# Altium schematic sheet POWER.SchDoc
size 386 x 304 mm
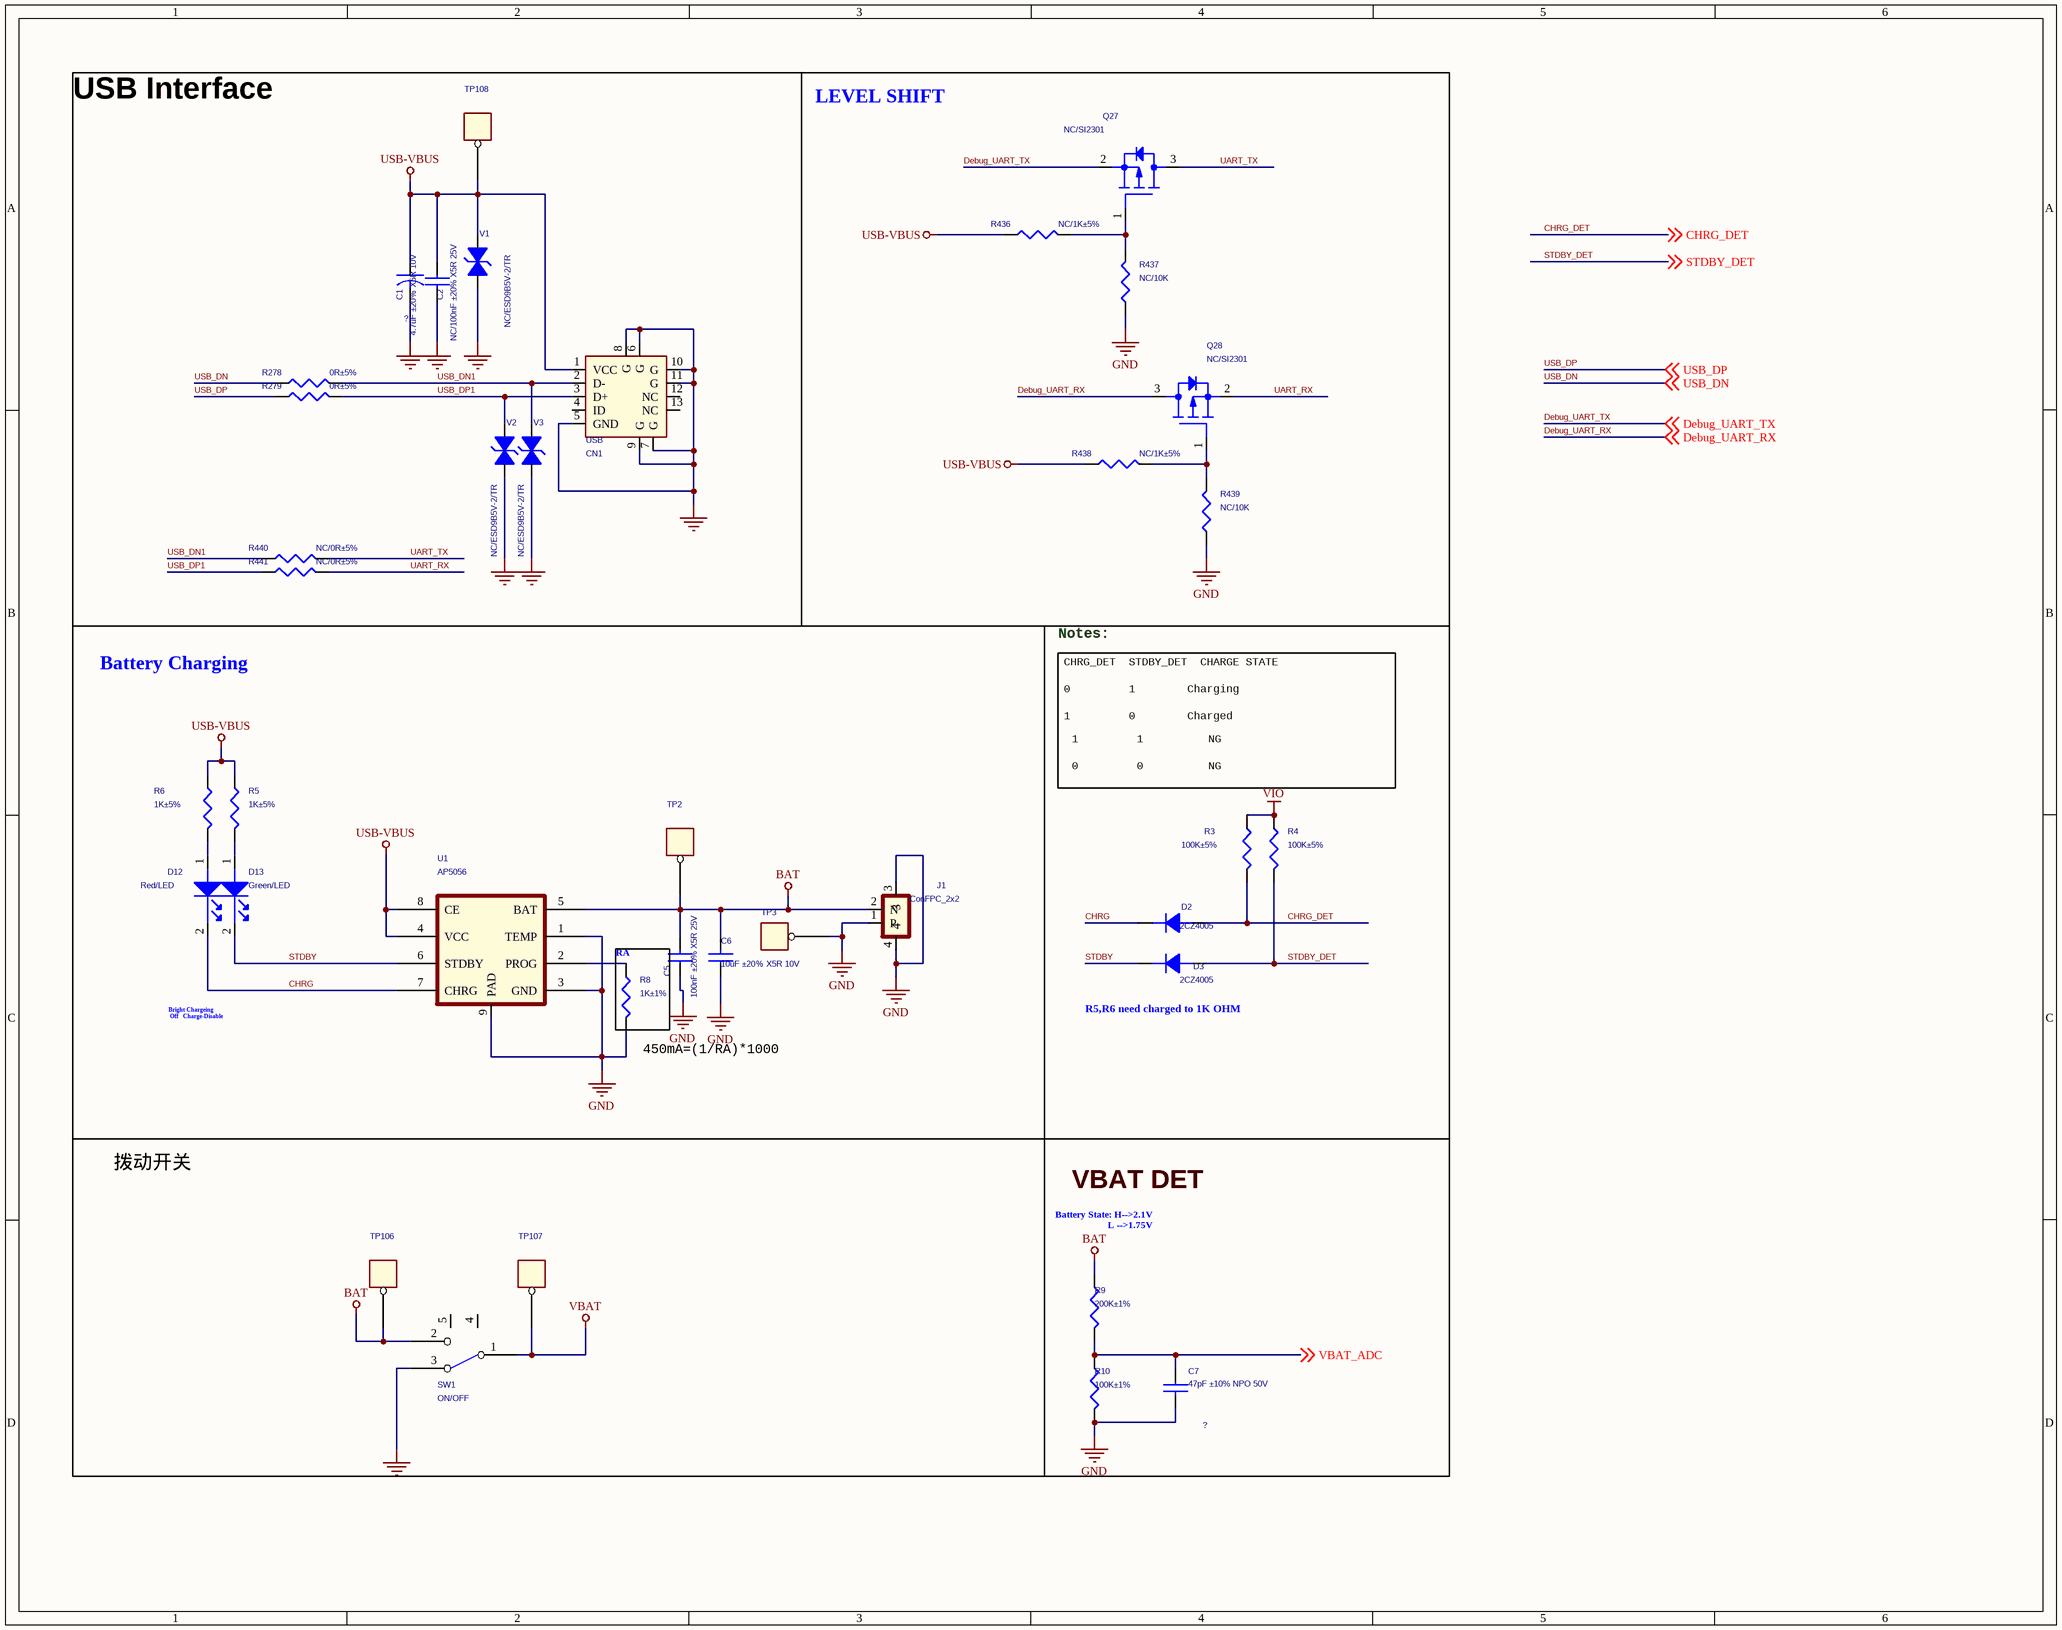
[diagram p0: POWER.SchDoc]

## Parts
C1  4.7uF ±20％ X5R 10V  [C0402]
C2  NC/100nF ±20% X5R 25V  [C0402]
C5  100nF ±20% X5R 25V  [C0402]
C6  10uF ±20％ X5R 10V  [C0603]
C7  47pF ±10% NPO 50V  [C0402]
CN1  USB  [USB_DIP5PA-GKFD]
D2  2CZ4005  [SOD-123]
D3  2CZ4005  [SOD-123]
D12  Red/LED  [LED0603]
D13  Green/LED  [LED0603]
J1  ConFPC_2x2  [PL2.0-2P-SMT]
Q27  NC/SI2301  [SOT-23]
Q28  NC/SI2301  [SOT-23]
R3  100K±5%  [R0402]
R4  100K±5%  [R0402]
R5  1K±5%  [R0402]
R6  1K±5%  [R0402]
R8  1K±1%  [R0402]
R9  200K±1%  [R0402]
R10  100K±1%  [R0402]
R278  0R±5%  [R0402]
R279  0R±5%  [R0402]
R436  NC/1K±5%  [R0402]
R437  NC/10K  [R0402]
R438  NC/1K±5%  [R0402]
R439  NC/10K  [R0402]
R440  NC/0R±5%  [R0402]
R441  NC/0R±5%  [R0402]
SW1  ON/OFF  [SW_1P2D-SK12D07VG3]
TP2  TP25RD  [TPC]  (value not drawn)
TP3  TP25RD  [TPC]  (value not drawn)
TP106  TP25RD  [TPC]  (value not drawn)
TP107  TP25RD  [TPC]  (value not drawn)
TP108  TP25RD  [TPC]  (value not drawn)
U1  AP5056  [SOP8_PAD]
V1  NC/ESD9B5V-2/TR  [ESD0402]
V2  NC/ESD9B5V-2/TR  [ESD0402]
V3  NC/ESD9B5V-2/TR  [ESD0402]

## Blocks framed on the sheet
USB Interface: C1 C2 CN1 R278 R279 R440 R441 TP108 V1-V3
LEVEL SHIFT: Q27 Q28 R436-R439
Battery Charging: C5 C6 D12 D13 J1 R5 R6 TP2 TP3 U1
Notes:: D2 D3 R3 R4
RA: R8
拨动开关: SW1 TP106 TP107
VBAT DET: C7 R9 R10

## Nets
BAT: C5.2 C6.2 J1.2(N) R9.1 SW1.2(NO) TP2.1(TP1) TP106.1(TP1) U1.5(BAT)
GND: C1.2 C2.2(Pin2) C5.1 C6.1 C7.2(Pin2) CN1.5(GND) CN1.6(G) CN1.7(G) CN1.8(G) CN1.9(G) CN1.10(G) CN1.11(G) J1.1(P) J1.3 J1.4 R8.1 R10.2 R437.1 R439.1 SW1.3(NC) TP3.1(TP1) U1.1(TEMP) U1.3(GND) U1.9(PAD) V1.2(I/O2) V2.2(I/O2) V3.2(I/O2)
USB-VBUS: C1.1 C2.1(Pin1) CN1.1(VCC) R5.2 R6.2 R436.1 R438.1 TP108.1(TP1) U1.4(VCC) U1.8(CE) V1.1(I/O1)
VBAT: SW1.1(COMMON) TP107.1(TP1)
VIO: R3.1 R4.1
CHRG: D2.2 D12.2(CATHODE) U1.7(CHRG)
CHRG_DET: D2.1 R3.2 ; off-sheet CHRG_DET
Debug_UART_RX: Q28.3(DRAIN) ; off-sheet Debug_UART_RX
Debug_UART_TX: Q27.2(SOURCE) ; off-sheet Debug_UART_TX
STDBY: D3.2 D13.2(CATHODE) U1.6(STDBY)
STDBY_DET: D3.1 R4.2 ; off-sheet STDBY_DET
UART_RX: Q28.2(SOURCE) R441.2
UART_TX: Q27.3(DRAIN) R440.2
USB_DN: R278.1 ; off-sheet USB_DN
USB_DN1: CN1.2(D-) R278.2 R440.1 V3.1(I/O1)
USB_DP: R279.1 ; off-sheet USB_DP
USB_DP1: CN1.3(D+) R279.2 R441.1 V2.1(I/O1)
VBAT_ADC: C7.1(Pin1) R9.2 R10.1 ; off-sheet VBAT_ADC
NetD12_1: D12.1(ANODE) R6.1
NetD13_1: D13.1(ANODE) R5.1
NetQ27_1: Q27.1(GATE) R436.2 R437.2
NetQ28_1: Q28.1(GATE) R438.2 R439.2
NetR8_2: R8.2 U1.2(PROG)

Not connected (* = marked no-connect by the designer): CN1 4(ID) 12(NC) 13(NC); SW1 4(NC) 5(NC)

## Notes on the sheet
- CHRG_DET  STDBY_DET  CHARGE STATE
- 0         1        Charging
- 1         0        Charged
- 1         1          NG
- 0         0          NG
- Bright Chargeing
  Off   Charge-Disable
- (near D3) R5,R6 need charged to 1K OHM
- (near R8) 450mA=(1/RA)*1000
- Battery State: H-->2.1V
  L -->1.75V

## Library data of the parts
C1 = CAP_Dup8: CISPartType: Capacitor\0603; PART_NUMBER: 105-35282-3475; Tolerance: +/-20%; AtherosDescription: CAP,0603,X5R,4.7uF,20%,6.3V; ATHEROS KEY: 032-475CM-001
C2 = CAP: PART_NUMBER: 105-35273-2104; CISPartType: Capacitor\0402; Tolerance: +/-10%; ATHEROS KEY: 031-104CK-002; AtherosDescription: CAP,0402,X5R,0.1uF,+/-10%,10V; Voltage: ?
C5 = CAP NP_Dup6
C6 = CAP NP_Dup4: Assembly: C0603
C7 = CAP_Dup9: PART_NUMBER: 105-35067-2470; CISPartType: Capacitor\0402; Tolerance: +/-5%; ATHEROS KEY: 031-470CJ-000; AtherosDescription: CAP,0402,NPO,47pF,+/-5%,50V; Voltage: ?
CN1 = USB TYPE A_5
D2 D3 = D_0: Allegro PCB Footprint: d2513A
D12 D13 = LED_0_Dup1
J1 = CON8_1
Q27 Q28 = PWRMOSFET_EP_GSD_0
R3-R6 R8 = RESISTOR_Dup4
R9 R10 R437 R439 = R_Dup5
R278 R279 R436 R438 R440 R441 = R_Dup2
SW1 = SW KEY-SPDT_0
TP2 TP3 TP106-TP108 = TEST_POINT: PAD_SM;TEST;0.025 ROUND; Part Number: G500-0000506; Compliance: NoData; BOM Notes: DNE; Type Package: SM PAD; Lifecycle: Full Production; Part Type: TEST POINT
U1 = AP5057 _1
V1-V3 = Varistor: Mutilayer Varistor,,5.5V,10PF; Manufacturer: Inpaq; Part_Number: EB3.100NV05402A; Part_Name: Varistor